# EAGLE design mk312_control (EAGLE 9.6.2)
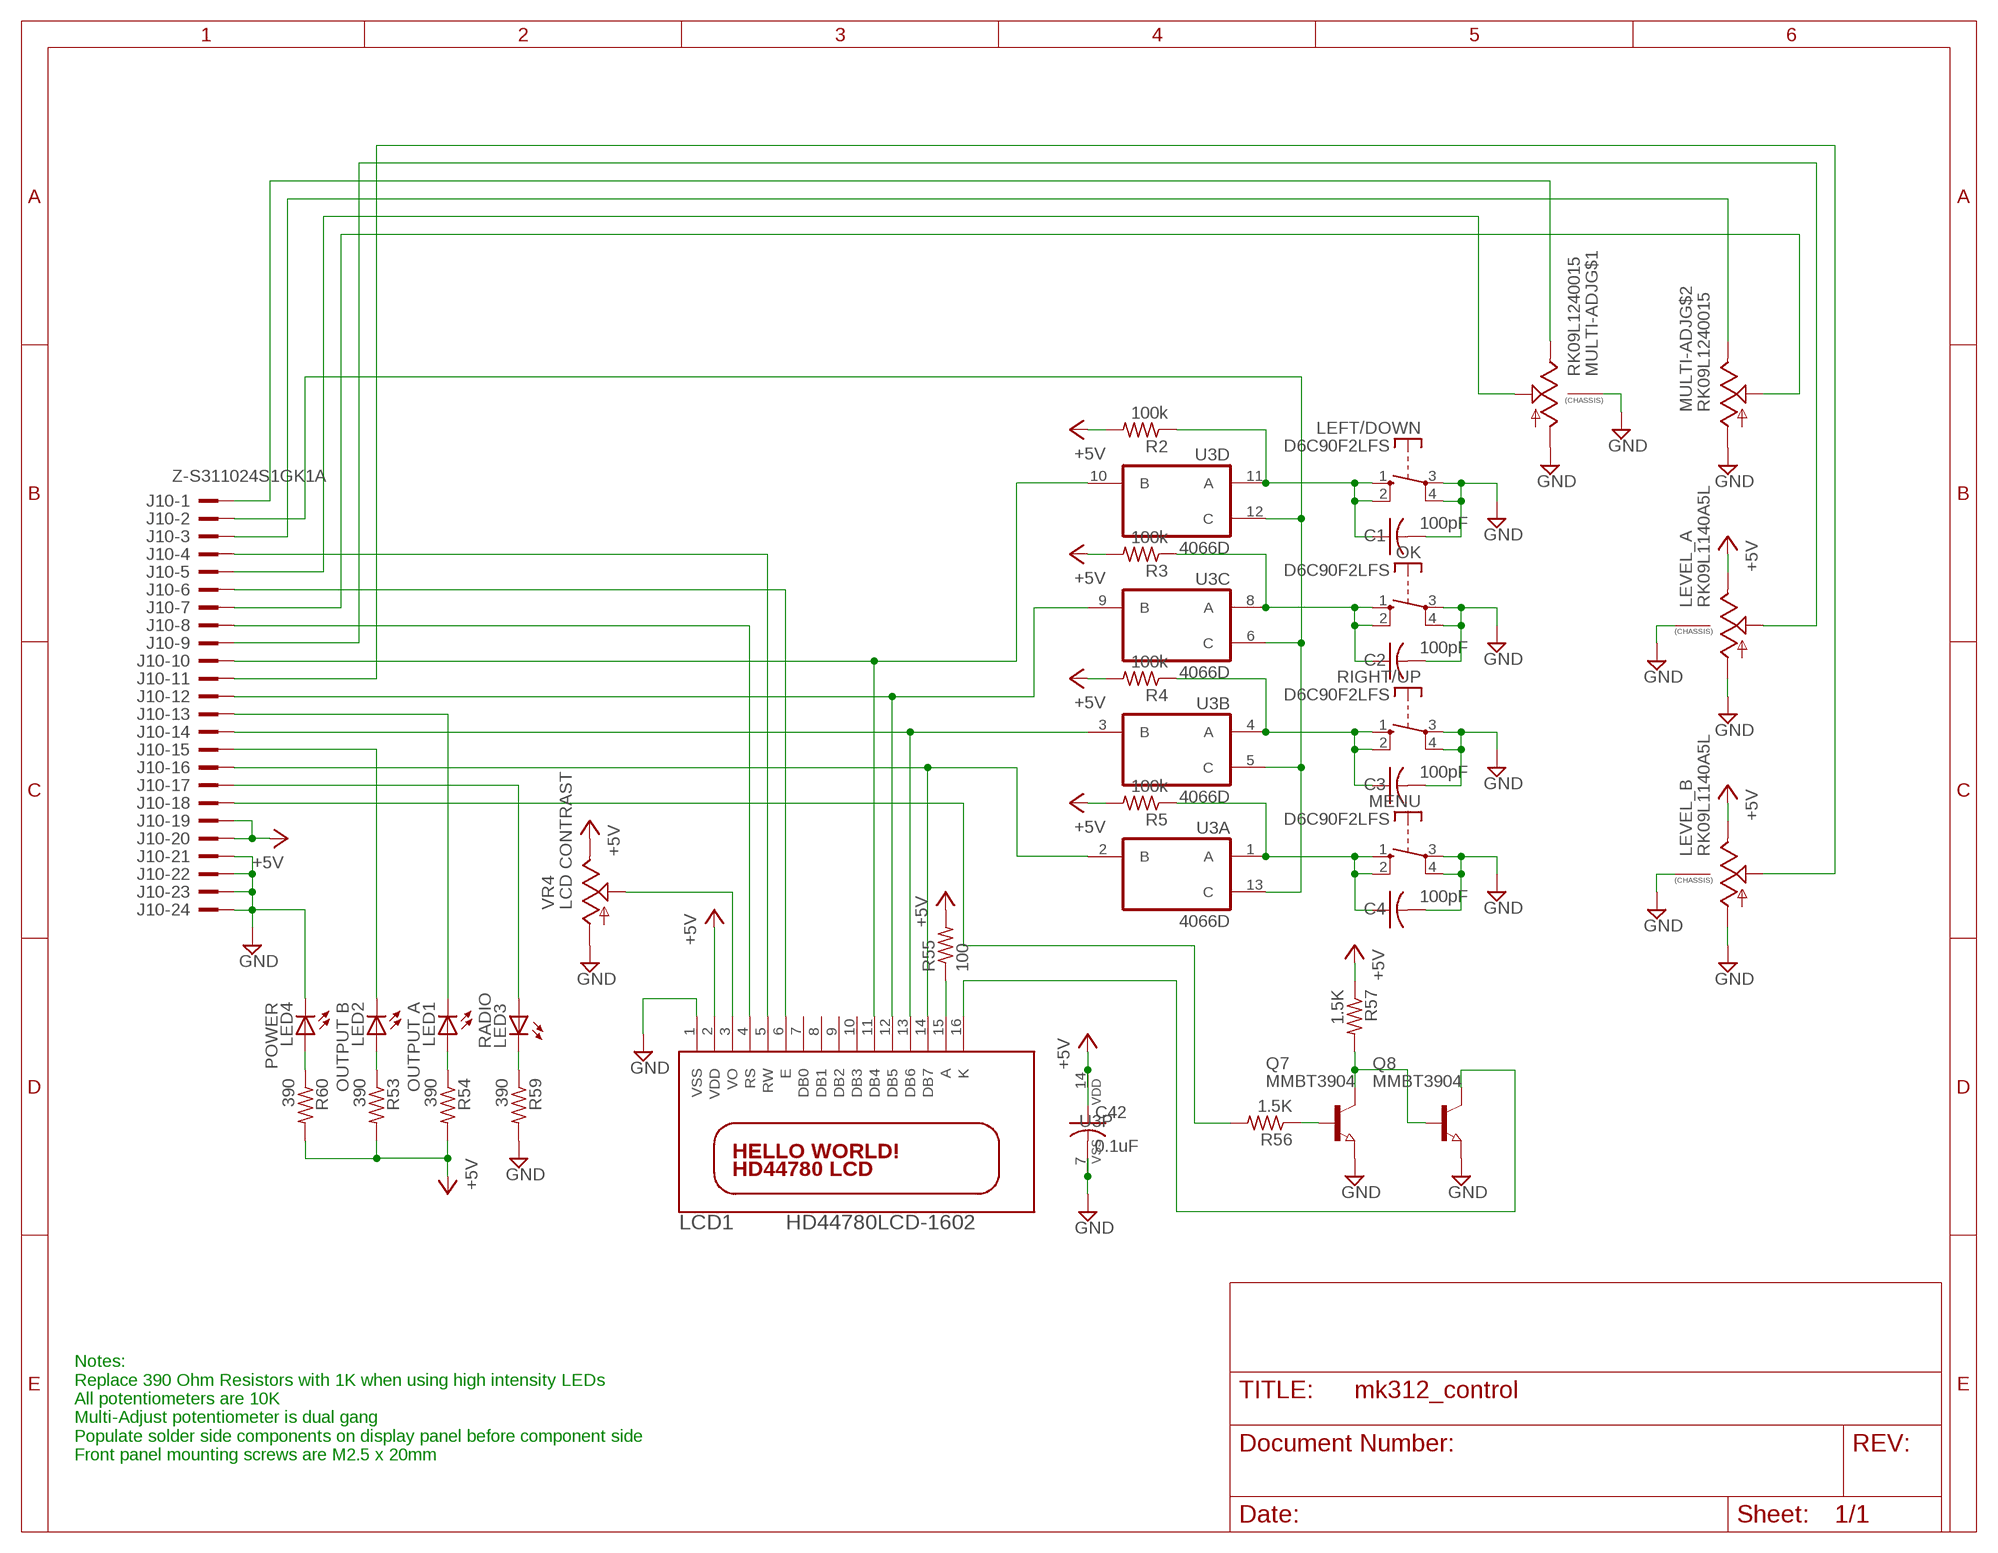
[diagram p0: schematic, sheet 1]

## Parts
C1  100pF  C-USC0805  [C0805]
C2  100pF  C-USC0805  [C0805]
C3  100pF  C-USC0805  [C0805]
C4  100pF  C-USC0805  [C0805]
C42  0.1uF  C-USC0805  [C0805]
J10  Z-S311024S1GK1A  2524-  [PAK100/2500-24]
LCD1  HD44780LCD-1602  [LCD1602]
LED1  OUTPUT A  LED5MM  [LED5MM]
LED2  OUTPUT B  LED5MM  [LED5MM]
LED3  RADIO  LED5MM  [LED5MM]
LED4  POWER  LED5MM  [LED5MM]
LEFT/DOWN  D6C90F2LFS  DTE6K  [DTE6K]
LEVEL_A  RK09L1140A5L  9MM_SNAP-IN_POT_CHASSIS  [9MM_SNAP-IN_POT]
LEVEL_B  RK09L1140A5L  9MM_SNAP-IN_POT_CHASSIS  [9MM_SNAP-IN_POT]
MENU  D6C90F2LFS  DTE6K  [DTE6K]
MULTI-ADJ  RK09L1240015  ALPHA-9MM-DUALPOT  [DUAL_9MM_SNAP-IN_POT]
OK  D6C90F2LFS  DTE6K  [DTE6K]
Q7  MMBT3904  T_NPN_MMBT3904_CHANGJ_SOT23-BEC  [SOT23]
Q8  MMBT3904  T_NPN_MMBT3904_CHANGJ_SOT23-BEC  [SOT23]
R2  100k  R-US_R0805  [R0805]
R3  100k  R-US_R0805  [R0805]
R4  100k  R-US_R0805  [R0805]
R5  100k  R-US_R0805  [R0805]
R53  390  R-US_R0805  [R0805]
R54  390  R-US_R0805  [R0805]
R55  100  R-US_R0805  [R0805]
R56  1.5K  R-US_R0805  [R0805]
R57  1.5K  R-US_R0805  [R0805]
R59  390  R-US_R0805  [R0805]
R60  390  R-US_R0805  [R0805]
RIGHT/UP  D6C90F2LFS  DTE6K  [DTE6K]
U3  4066D  [SO14]
VR4  LCD CONTRAST  TRIM_US-B25P  [B25P]

## Nets
+5V [pwr]: C42.1 J10.19 J10.20 LCD1.2(VDD) LEVEL_A.3(E) LEVEL_B.3(E) R2.2 R3.2 R4.2 R5.2 R53.2 R54.2 R55.2 R57.1 R60.2 U3.14(P:VDD) VR4.E
GND [pwr]: C1.2 C2.2 C3.2 C4.2 C42.2 J10.21 J10.22 J10.23 J10.24 LCD1.1(VSS) LED4.K(C) LEFT/DOWN.3(P) LEFT/DOWN.4(P) LEVEL_A.1(A) LEVEL_A.CHASSIS2 LEVEL_B.1(A) LEVEL_B.CHASSIS2 MENU.3(P) MENU.4(P) MULTI-ADJ.1(A) MULTI-ADJ.1B(A) MULTI-ADJ.CHASSIS1 MULTI-ADJ.CHASSIS2 OK.3(P) OK.4(P) Q7.2(E) Q8.2(E) R59.2 RIGHT/UP.3(P) RIGHT/UP.4(P) U3.7(P:VSS) VR4.A
N$1: J10.7 MULTI-ADJ.2B(S)
N$4: C2.1 OK.1(S) OK.2(S) R3.1 U3.8(C:A)
N$5: C1.1 LEFT/DOWN.1(S) LEFT/DOWN.2(S) R2.1 U3.11(D:A)
N$7: C3.1 R4.1 RIGHT/UP.1(S) RIGHT/UP.2(S) U3.4(B:A)
N$10: J10.3 MULTI-ADJ.3B(E)
N$11: J10.9 LEVEL_A.2(S)
N$12: J10.11 LEVEL_B.2(S)
N$13: J10.1 MULTI-ADJ.3(E)
N$15: J10.5 MULTI-ADJ.2(S)
N$23: LED2.A R53.1
N$29: LED1.A R54.1
N$30: LCD1.3(VO) VR4.S
N$47: LCD1.15(A) R55.1
N$79: LED3.K(C) R59.1
N$80: C4.1 MENU.1(S) MENU.2(S) R5.1 U3.1(A:A)
N$81: LED4.A R60.1
N$82: Q7.1(B) R56.1
N$83: Q7.3(C) Q8.1(B) R57.2
N$84: LCD1.16(K) Q8.3(C)
N$86: J10.17 LED3.A
PC0: J10.2 U3.5(B:C) U3.6(C:C) U3.12(D:C) U3.13(A:C)
PC1: J10.4 LCD1.5(RW)
PC2: J10.6 LCD1.6(E)
PC3: J10.8 LCD1.4(RS)
PC4: J10.10 LCD1.11(DB4) U3.10(D:B)
PC5: J10.12 LCD1.12(DB5) U3.9(C:B)
PC6: J10.14 LCD1.13(DB6) U3.3(B:B)
PC7: J10.16 LCD1.14(DB7) U3.2(A:B)
PD5: J10.15 LED2.K(C)
PD6: J10.13 LED1.K(C)
PD7: J10.18 R56.2
Unconnected: LCD1.7(DB0) LCD1.8(DB1) LCD1.9(DB2) LCD1.10(DB3)

## Notes on the sheet
- Notes:
  Replace 390 Ohm Resistors with 1K when using high intensity LEDs
  All potentiometers are 10K
  Multi-Adjust potentiometer is dual gang
  Populate solder side components on display panel before component side
  Front panel mounting screws are M2.5 x 20mm

## Library data of the parts
C1-C4 = rcl:C-US: CAPACITOR, American symbol; SPICEPREFIX: C
C42 = rcl:C-US: CAPACITOR, American symbol
J10 = con-3m:2524-: 3M (TM) Pak 100 4-Wall Header Source: 3M; OC_FARNELL: unknown; OC_NEWARK: unknown
LCD1 = adafruit:HD44780LCD: HD44780 LCD Standard character type LCDs, available in sizes from 8x1 to 40x4!
LED1-LED4 = led:LED: LED OSRAM: - CHIPLED LG R971, LG N971, LY N971, LG Q971, LY Q971, LO R971, LY R971 LH N974, LH R974 LS Q976, LO Q976, LY Q976 LO Q996 - Hyper CHIPLED LW Q18S LB Q993, LB Q99A, LB R99A - SideLED LS A670, LO A670, LY A670, LG A670, LP A670 LB A673, LV A673, LT A673, LW A673 LH A674 LY A675 LS A676, LA A676, LO A676, LY A676, LW A676 LS A679, LY A679, LG A679 - Hyper Micro SIDELED® LS Y876, LA Y876, LO Y876, LY Y876 LT Y87S - SmartLED LW L88C, LW L88S LB L89C, LB L89S, LG L890 LS L89K, LO L89K, LY L89K LS L896, LA L896, LO L896, LY L896 - TOPLED LS T670, LO T670, LY T670, LG T670, LP T670 LSG T670, LSP T670, LSY T670, LOP T670, LYG T670 LG T671, LOG T671, LSG T671 LB T673, LV T673, LT T673, LW T673 LH T674 LS T676, LA T676, LO T676, LY T676, LB T676, LH T676, LSB T676, LW T676 LB T67C, LV T67C, LT T67C, LS T67K, LO T67K, LY T67K, LW E67C LS E67B, LA E67B, LO E67B, LY E67B, LB E67C, LV E67C, LT E67C LW T67C LS T679, LY T679, LG T679 LS T770, LO T770, LY T770, LG T770, LP T770 LB T773, LV T773, LT T773, LW T773 LH T774 LS E675, LA E675, LY E675, LS T675 LS T776, LA T776, LO T776, LY T776, LB T776 LHGB T686 LT T68C, LB T68C - Hyper Mini TOPLED® LB M676 - Mini TOPLED Santana® LG M470 LS M47K, LO M47K, LY M47K Source: http://www.osram.convergy.de LUXEON: - LUMILED® LXK2-PW12-R00, LXK2-PW12-S00, LXK2-PW14-U00, LXK2-PW14-V00 LXK2-PM12-R00, LXK2-PM12-S00, LXK2-PM14-U00 LXK2-PE12-Q00, LXK2-PE12-R00, LXK2-PE12-S00, LXK2-PE14-T00, LXK2-PE14-U00 LXK2-PB12-K00, LXK2-PB12-L00, LXK2-PB12-M00, LXK2-PB14-N00, LXK2-PB14-P00, LXK2-PB14-Q00 LXK2-PR12-L00, LXK2-PR12-M00, LXK2-PR14-Q00, LXK2-PR14-R00 LXK2-PD12-Q00, LXK2-PD12-R00, LXK2-PD12-S00 LXK2-PH12-R00, LXK2-PH12-S00 LXK2-PL12-P00, LXK2-PL12-Q00, LXK2-PL12-R00 Source: www.luxeon.com KINGBRIGHT: KA-3528ASYC Source: www.kingbright.com
LEFT/DOWN MENU OK RIGHT/UP = switch-misc:DT: ITT SWITCH
LEVEL_A LEVEL_B = MusicThingModular:9MM_SNAP-IN_POT_CHASSIS: 9mm vertical snap-in pot, Alpha / Panasonic style, with a connection to the metal chassis for grounding
MULTI-ADJ = MusicThingModular:ALPHA-9MM-DUALPOT: 9mm vertical snap-in pot, Alpha / Panasonic style, with a connection to the metal chassis for grounding
Q7 Q8 = JLC PCB Basic Parts_loc:T_NPN_: Transistor NPN; LCSC_DATASHEET: https://datasheet.lcsc.com/lcsc/1811011934_Changjiang-Electronics-Tech--CJ-MMBT3904_C20526.pdf; LCSC_PART: C20526; LCSC_ROTATION_CCW: 180; LCSC_STOCK: 1041615; PROPERTIES: 40V 200mW 200mA 100@10mA,1V 300MHz 300mV@50mA,5mA NPN +150°C@(Tj) SOT-23(SOT-23-3) Bipolar Transistors - BJT ROHS
R2-R5 = rcl:R-US_: RESISTOR, American symbol; SPICEPREFIX: R
R53-R57 R59 R60 = rcl:R-US_: RESISTOR, American symbol
U3 = 40xx:4066: Quad bilateral ANALOG SWITCH
VR4 = pot:TRIM_US-: POTENTIOMETER

## Net classes
0 default: width 0.3 mm, clearance 0.203 mm
1 signal: width 0.3 mm, clearance 0.203 mm
2 pwr: width 0.8 mm, clearance 0.203 mm

## Board
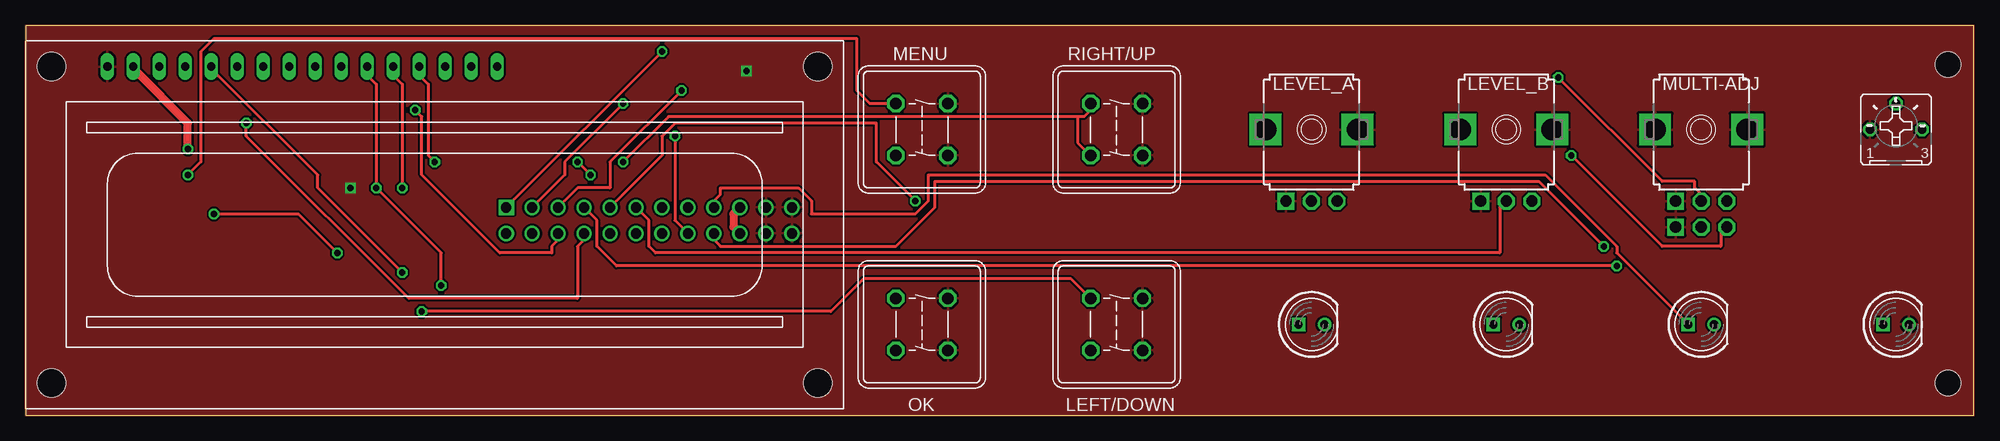
[diagram p1: board, top side]
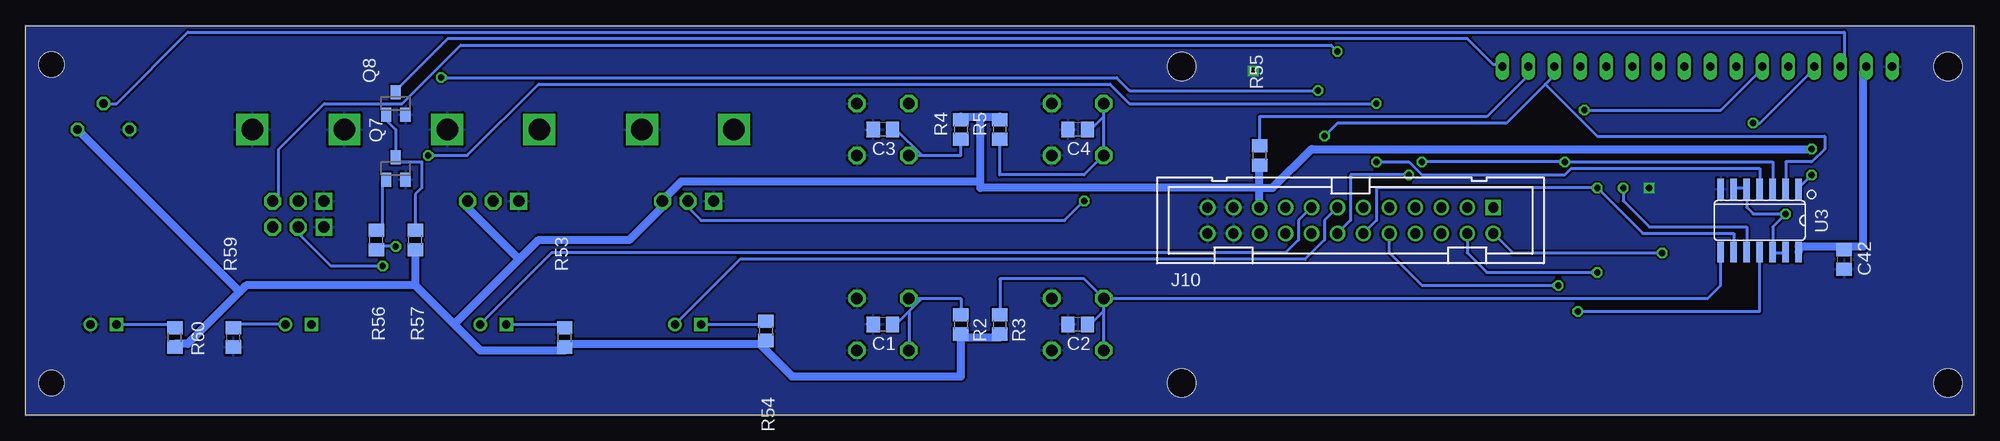
[diagram p2: board, bottom side, seen from below]

Size 190.5 x 38.1 mm. Coordinates in mm from the lower left corner, seen from the top.
Outline: 0,0 190.48,0 190.5,38.1 0,38.1 0,0
Copper layers (1*16): Top 0.035mm / dielectric 1.5mm / Bottom 0.035mm
Design rules "default *": minimum track width 10mil, minimum drill 24mil, track to track 8mil, track to pad 8mil, pad to pad 8mil, via to via 8mil, smd to smd 8mil, copper to edge 0mil, drill to drill 8mil, minimum pad ring 10mil, minimum via ring 8mil, stop-mask expansion 4mil, vias tented up to drill 0mil, thermal gap 10mil
Holes 2.5 mm at 187.96,34.29 187.96,3.17

### Footprints (pad centres in the part's own frame; a part is rotated, then mirrored left to right if it is on the bottom)
C0805 = smd 1.3 x 1.5: 1 -0.95,0; 2 0.95,0
PAK100/2500-24 = drill 1 pad 1.422 square: 1 -13.97,-1.27 | drill 1 pad 1.422: 2 -13.97,1.27; 3 -11.43,-1.27; 4 -11.43,1.27; 5 -8.89,-1.27; 6 -8.89,1.27; 7 -6.35,-1.27; 8 -6.35,1.27; 9 -3.81,-1.27; 10 -3.81,1.27; 11 -1.27,-1.27; 12 -1.27,1.27; 13 1.27,-1.27; 14 1.27,1.27; 15 3.81,-1.27; 16 3.81,1.27; 17 6.35,-1.27; 18 6.35,1.27; 19 8.89,-1.27; 20 8.89,1.27; 21 11.43,-1.27; 22 11.43,1.27; 23 13.97,-1.27; 24 13.97,1.27
LCD1602 = drill 0.8 long: 1 8,33.46; 2 10.54,33.46; 3 13.08,33.46; 4 15.62,33.46; 5 18.16,33.46; 6 20.7,33.46; 7 23.24,33.46; 8 25.78,33.46; 9 28.32,33.46; 10 30.86,33.46; 11 33.4,33.46; 12 35.94,33.46; 13 38.48,33.46; 14 41.02,33.46; 15 43.56,33.46; 16 46.1,33.46 | hole 2.8: 2.54,2.54; 2.54,33.46; 77.46,33.46; 77.46,2.54
LED5MM = drill 0.813 square: A -1.27,0 | drill 0.813: K 1.27,0
DTE6K = drill 1.118 octagon: 1 -2.54,2.54; 2 2.54,2.54; 3 2.54,-2.54; 4 -2.54,-2.54
9MM_SNAP-IN_POT = drill 1.1 square: 1 -2.5,-7 | drill 1.1 octagon: 2 0,-7; 3 2.5,-7 | drill 2.1 square: CHASSIS1 -4.5,0; CHASSIS2 4.5,0
DUAL_9MM_SNAP-IN_POT = drill 1.1 square: 1 -2.5,-7; 1B -2.5,-9.54 | drill 1.1 octagon: 2 0,-7; 2B 0,-9.54; 3 2.5,-7; 3B 2.5,-9.54 | drill 2.1 square: CHASSIS1 -4.5,0; CHASSIS2 4.5,0
SOT23 = smd 1.4 x 1: 1 -1.1,0.95; 2 -1.1,-0.95; 3 1.1,0
R0805 = smd 1.3 x 1.5: 1 -0.95,0; 2 0.95,0
SO14 = smd 0.66 x 2.032: 1 -3.81,-3.073; 2 -2.54,-3.073; 3 -1.27,-3.073; 4 0,-3.073; 5 1.27,-3.073; 6 2.54,-3.073; 7 3.81,-3.073; 8 3.81,3.073; 9 2.54,3.073; 10 1.27,3.073; 11 0,3.073; 12 -1.27,3.073; 13 -2.54,3.073; 14 -3.81,3.073
B25P = drill 0.813 octagon: A -2.54,0; E 2.54,0; S 0,2.54

### Placement (x,y rotation side)
C1  106.68,8.89 180 bottom
C2  87.63,8.89 180 bottom
C3  106.68,27.94 180 bottom
C4  87.63,27.94 180 bottom
C42  12.7,15.24 270 bottom
J10  60.96,19.05 180 bottom
LCD1  0,0.64 0 top
LED1  125.73,8.89 0 top
LED2  144.78,8.89 0 top
LED3  163.83,8.89 0 top
LED4  182.88,8.89 0 top
LEFT/DOWN  106.68,8.89 90 top
LEVEL_A  125.73,27.94 0 top
LEVEL_B  144.78,27.94 0 top
MENU  87.63,27.94 90 top
MULTI-ADJ  163.83,27.94 0 top
OK  87.63,8.89 90 top
Q7  154.31,24.13 90 bottom
Q8  154.31,30.48 90 bottom
R2  99.06,8.89 270 bottom
R3  95.25,8.89 270 bottom
R4  99.06,27.94 90 bottom
R5  95.25,27.94 90 bottom
R53  137.79,7.62 270 bottom
R54  118.11,8.26 270 bottom
R55  69.85,25.4 270 bottom
R56  156.21,17.14 270 bottom
R57  152.4,17.14 90 bottom
R59  170.18,7.62 270 bottom
R60  175.9,7.62 270 bottom
RIGHT/UP  106.68,27.94 90 top
U3  20.95,19.05 180 bottom
VR4  182.88,27.94 0 top

### Tracks (layer width: path | path; a pad name or v marks a point on that pad's centre or on a via)
+5V  (via drill 0.61)
  Top 0.8: J10.20 69.22,18.41 69.22,19.68 J10.19 | v15.88,26.04 15.88,28.57 10.79,33.66 LCD1.2
  Bottom 0.8: 12.7,16.51 17.14,16.51 U3.14 | 12.7,16.51 10.79,16.51 10.79,33.66 LCD1.2 | 12.7,16.51 C42.1 | 97.16,29.21 99.06,29.21 R4.2 | 97.16,29.21 95.25,29.21 R5.2 | J10.19 69.85,22.23 | 69.85,22.23 R55.2 | 97.16,22.86 97.16,22.23 69.85,22.23 | 97.16,22.86 97.16,29.21 | v15.88,26.04 64.77,26.04 68.58,22.23 69.85,22.23 | 99.06,7.62 95.25,7.62 R3.2 | 152.4,12.7 148.59,8.89 | 148.59,8.89 146.05,6.35 137.79,6.35 R53.2 137.79,6.99 118.75,6.99 | R57.1 152.4,12.7 | 169.54,12.06 168.91,12.7 152.4,12.7 | 169.54,12.06 174.62,6.99 175.9,6.99 R60.2 | 118.75,6.99 118.11,6.99 R54.2 118.75,6.99 | 169.54,12.06 VR4.E | 99.06,7.62 99.06,3.81 115.57,3.81 118.75,6.99 | 99.06,7.62 R2.2 | 148.59,8.89 142.24,15.24 | 142.24,15.24 140.34,17.14 131.44,17.14 128.27,20.32 LEVEL_A.3 128.27,20.95 126.36,22.86 97.16,22.86 | 142.24,15.24 147.32,20.32 LEVEL_B.3
GND  (via drill 0.61)
  other vias: 31.75,22.23 70.48,33.66
  pour Bottom: 0,38.1 190.5,38.1 190.5,0 0,0
  pour Top: 0,38.1 190.5,38.1 190.5,0 0,0
N$1  (via drill 0.61)
  Top 0.3: J10.7 55.88,19.05 55.88,16.51 57.78,14.61 v155.57,14.61
  Bottom 0.3: v155.57,14.61 160.66,14.61 163.83,17.78 MULTI-ADJ.2B
N$4
  Bottom 0.3: 85.09,10.16 86.36,8.89 C2.1 | OK.2 85.09,10.16 | R3.1 95.25,13.34 87,13.34 OK.2 | OK.2 26.04,11.43 24.77,12.7 U3.8 | 85.09,10.16 OK.1
N$5  (via drill 0.61)
  Top 0.3: LEFT/DOWN.2 102.23,13.34 81.92,13.34 78.74,10.16 v38.73,10.16
  Bottom 0.3: R2.1 99.06,11.43 102.87,11.43 | LEFT/DOWN.2 102.87,11.43 | 102.87,11.43 104.14,10.16 | 104.14,10.16 105.41,8.89 C1.1 | U3.11 20.95,10.16 v38.73,10.16 | 104.14,10.16 LEFT/DOWN.1
N$7  (via drill 0.61)
  Top 0.3: v58.42,24.77 62.87,29.21 102.87,29.21 | 102.87,29.21 103.5,29.21 104.14,29.84 RIGHT/UP.2 | RIGHT/UP.1 102.87,26.67 102.87,29.21
  Bottom 0.3: R4.1 99.06,25.4 102.87,25.4 | RIGHT/UP.1 102.87,25.4 | 102.87,25.4 105.41,27.94 C3.1 | U3.4 20.95,24.13 39.37,24.13 40.01,23.5 53.98,23.5 55.24,24.77 v58.42,24.77
N$10  (via drill 0.61)
  Top 0.3: J10.3 52.7,23.5 52.7,24.77 v58.42,30.48 | v151.13,25.4 160.02,16.51 165.74,16.51 165.74,18.41 MULTI-ADJ.3B
  Bottom 0.3: v58.42,30.48 82.55,30.48 84.45,32.38 140.34,32.38 147.32,25.4 v151.13,25.4
N$11  (via drill 0.61)
  Top 0.3: J10.9 62.23,25.4 62.23,27.3 63.5,28.57 83.19,28.57 83.19,24.77 v87,20.95
  Bottom 0.3: v87,20.95 88.9,19.05 124.46,19.05 125.73,20.32 LEVEL_A.2
N$12
  Top 0.3: J10.11 60.96,19.05 60.96,16.51 61.59,15.88 144.15,15.88 144.15,20.32 144.78,20.95 LEVEL_B.2
N$13  (via drill 0.61)
  Top 0.3: v62.23,35.56 J10.1
  Bottom 0.3: v62.23,35.56 62.87,36.2 147.96,36.2 153.67,30.48 161.29,30.48 165.74,26.04 165.74,20.95 MULTI-ADJ.3
N$15  (via drill 0.61)
  Top 0.3: J10.5 53.98,22.23 57.15,22.23 57.15,24.77 v64.14,31.75 | v149.86,33.02 160.02,22.86 163.19,22.86 163.19,22.23 163.83,21.59 MULTI-ADJ.2
  Bottom 0.3: v64.14,31.75 82.55,31.75 83.82,33.02 v149.86,33.02
N$23
  Bottom 0.3: LED2.A 137.79,8.89 R53.1
N$29
  Bottom 0.3: LED1.A 118.11,8.89 R54.1
N$30
  Bottom 0.3: VR4.S 181.61,30.48 174.62,37.47 12.7,37.47 12.7,34.29 LCD1.3
N$47
  Bottom 0.3: R55.1 69.85,29.21 47.62,29.21 43.18,33.66 LCD1.15
N$79
  Bottom 0.3: LED3.K 170.18,8.89 R59.1
N$80  (via drill 0.61)
  Top 0.3: v15.88,23.5 17.14,24.77 17.14,35.56 18.41,36.83 81.28,36.83 81.28,31.75 82.55,30.48 MENU.2
  Bottom 0.3: R5.1 95.25,23.5 87,23.5 MENU.1 85.09,29.21 | 85.09,29.21 86.36,27.94 C4.1 | MENU.2 85.09,29.21 | v15.88,23.5 17.14,22.23 U3.1
N$81
  Bottom 0.3: LED4.A 175.9,8.89 R60.1
N$82
  Bottom 0.3: Q7.1 155.57,22.86 155.57,18.41 156.21,18.41 R56.1
N$83
  Bottom 0.3: Q8.1 155.57,29.21 154.31,27.94 Q7.3 154.31,24.77 151.76,24.77 151.76,22.23 152.4,21.59 R57.2
N$84
  Bottom 0.3: Q8.3 154.31,31.75 149.22,36.83 49.53,36.83 46.99,34.29 46.35,34.29 LCD1.16
N$86
  Top 0.3: LED3.A 155.57,15.88 155.57,16.51 148.59,23.5 88.27,23.5 88.27,20.95 87,19.68 76.83,19.68 76.83,20.95 75.56,22.23 67.94,22.23 67.94,21.59 67.31,20.95 J10.17
PC0  (via drill 0.61)
  Top 0.3: v30.48,15.88 26.67,19.68 v18.41,19.68
  Bottom 0.3: U3.13 18.41,15.88 19.68,15.88 U3.12 19.68,18.41 v18.41,19.68 21.59,19.68 22.23,20.32 U3.5 22.23,22.23 23.5,22.23 U3.6 | v30.48,15.88 45.09,15.88 J10.2
PC1  (via drill 0.61)
  Top 0.3: v36.83,13.97 28.57,22.23 28.57,23.5 18.41,33.66 LCD1.5
  Bottom 0.3: v36.83,13.97 47.62,13.97 49.53,15.88 J10.4
PC2  (via drill 0.61)
  Top 0.3: v38.1,29.84 38.73,29.21 38.73,23.5 46.35,15.88 51.44,15.88 51.44,16.51 52.07,17.14 J10.6
  Bottom 0.3: v38.1,29.84 24.77,29.84 20.95,33.66 LCD1.6
PC3  (via drill 0.61)
  Top 0.3: v21.59,28.57 21.59,27.3 37.47,11.43 53.98,11.43 53.98,16.51 54.61,17.14 J10.8
  Bottom 0.3: v21.59,28.57 20.95,28.57 15.88,33.66 LCD1.4
PC4  (via drill 0.61)
  Top 0.3: LCD1.11 33.66,33.66 33.66,33.02 34.29,32.38 v34.29,22.23 40.64,15.88 v40.64,12.7
  Bottom 0.3: U3.10 22.23,18.41 31.75,18.41 34.29,20.95 v34.29,22.23 | J10.10 57.15,15.88 53.98,12.7 v40.64,12.7
PC5  (via drill 0.61)
  Top 0.3: v36.83,22.23 36.83,32.38 36.2,33.02 36.2,33.66 LCD1.12
  Bottom 0.3: U3.9 23.5,17.78 32.38,17.78 v36.83,22.23 58.42,22.23 58.42,19.05 J10.12
PC6  (via drill 0.61)
  Top 0.3: v40.01,24.77 39.37,25.4 39.37,32.38 38.73,33.02 38.73,33.66 LCD1.13 | v53.98,24.77 v55.24,23.5
  Bottom 0.3: U3.3 19.68,24.77 v40.01,24.77 v53.98,24.77 | J10.14 60.96,19.05 60.96,23.5 v55.24,23.5
PC7  (via drill 0.61)
  Top 0.3: J10.16 63.5,19.05 v63.5,27.3
  Bottom 0.3: U3.2 18.41,24.77 15.88,24.77 14.61,26.04 14.61,27.3 36.83,27.3 41.91,32.38 | 41.91,32.38 40.64,33.66 LCD1.14 | v63.5,27.3 62.23,28.57 45.72,28.57 41.91,32.38
PD5
  Bottom 0.3: LED2.K 139.06,15.88 67.31,15.88 66.04,17.14 66.04,19.05 J10.15
PD6
  Bottom 0.3: LED1.K 120.65,15.24 65.41,15.24 63.5,17.14 63.5,19.05 J10.13
PD7  (via drill 0.61)
  Top 0.3: v154.31,16.51 147.96,22.86 88.9,22.86 88.9,20.32 85.09,16.51 67.94,16.51 67.31,17.14 J10.18
  Bottom 0.3: v154.31,16.51 156.21,16.51 R56.2